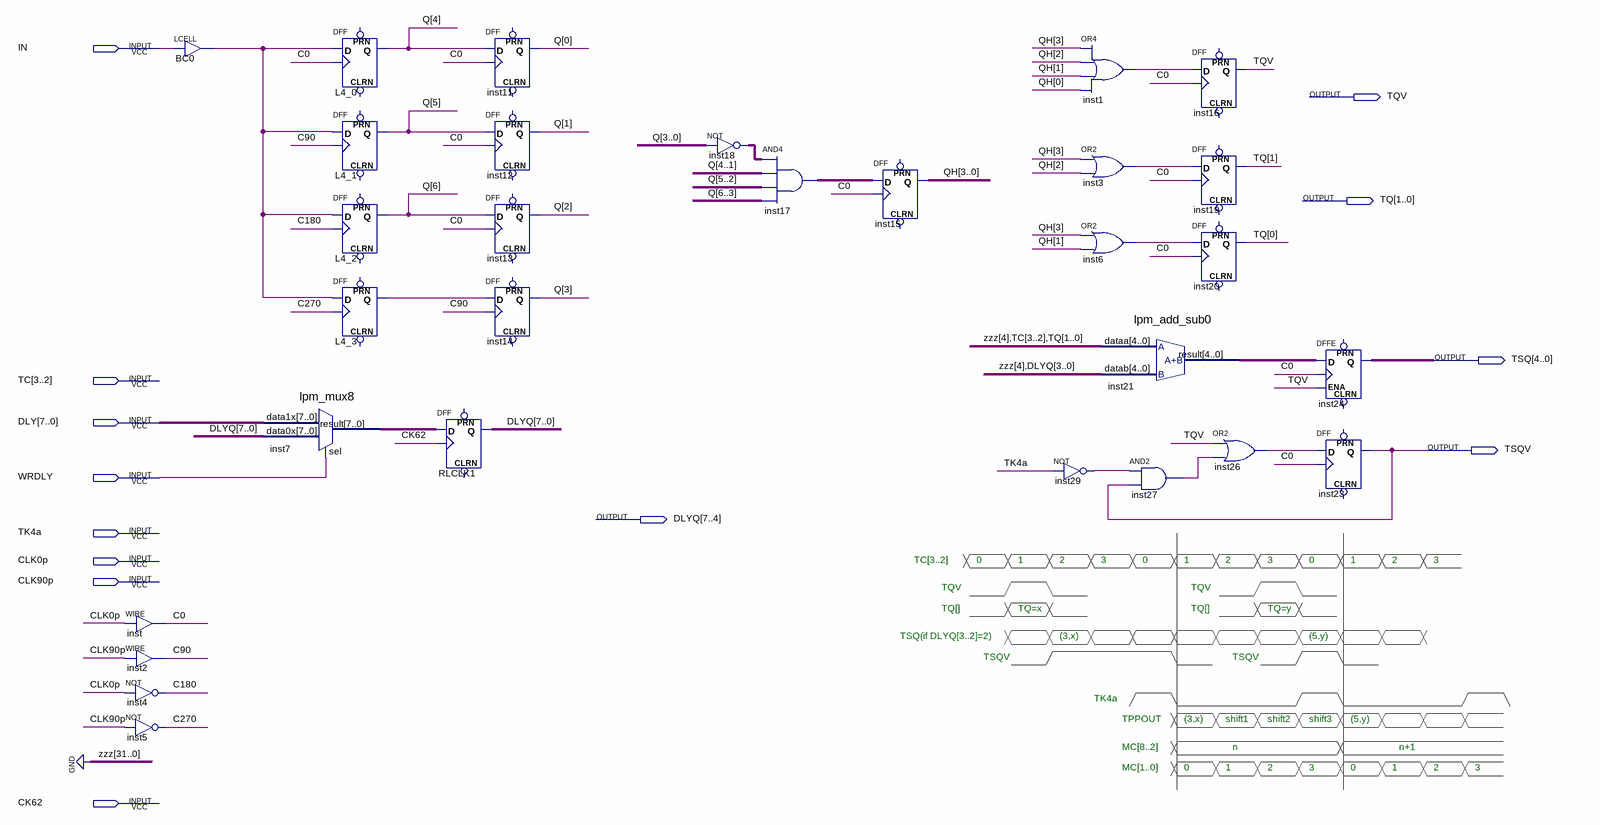
[diagram p0: schematic sheet]
// Quartus schematic Smaple4sh16a.bdf as structural Verilog: 30 symbols, 13 pins
module Smaple4sh16a (
  input  IN,
  input  [3:2] TC,
  input  [7:0] DLY,
  input  WRDLY,
  input  TK4a,
  input  CLK0p,
  input  CLK90p,
  input  CK62,
  output TQV,
  output [1:0] TQ,
  output [4:0] TSQ,
  output TSQV,
  output [7:0] DLYQ
);

  wire BC0_out, C0, C90, C180, C270, inst1_out, inst3_out, inst6_out, inst26_out, inst27_out, inst29_out,
       L4_3_q;
  wire [3:0] inst17_out, inst18_out, QH;
  wire [4:0] inst21_result;
  wire [6:0] Q;
  wire [7:0] inst7_result;

  assign C0 = CLK0p;  // WIRE inst
  assign C90 = CLK90p;  // WIRE inst2
  not inst4 (C180, CLK0p);
  not inst5 (C270, CLK90p);
  LCELL BC0 (.IN(IN), .OUT(BC0_out));
  lpm_mux8 inst7 (.data1x(DLY), .data0x(DLYQ), .sel(WRDLY), .result(inst7_result));
  DFF L4_0 (.CLK(C0), .D(BC0_out), .Q(Q[4]));  // open: CLRN, PRN
  DFF L4_1 (.CLK(C90), .D(BC0_out), .Q(Q[5]));  // open: CLRN, PRN
  DFF L4_2 (.CLK(C180), .D(BC0_out), .Q(Q[6]));  // open: CLRN, PRN
  DFF L4_3 (.CLK(C270), .D(BC0_out), .Q(L4_3_q));  // open: CLRN, PRN
  DFF RLCLK1[7:0] (.CLK(CK62), .D(inst7_result), .Q(DLYQ));  // open: CLRN, PRN
  DFF inst11 (.CLK(C0), .D(Q[4]), .Q(Q[0]));  // open: CLRN, PRN
  DFF inst12 (.CLK(C0), .D(Q[5]), .Q(Q[1]));  // open: CLRN, PRN
  DFF inst13 (.CLK(C0), .D(Q[6]), .Q(Q[2]));  // open: CLRN, PRN
  DFF inst14 (.CLK(C90), .D(L4_3_q), .Q(Q[3]));  // open: CLRN, PRN
  assign inst18_out = ~Q[3:0];  // NOT inst18, 4 bits wide
  assign inst17_out = inst18_out & Q[4:1] & Q[5:2] & Q[6:3];  // AND4 inst17, 4 bits wide
  DFF inst15[3:0] (.CLK(C0), .D(inst17_out), .Q(QH));  // open: CLRN, PRN
  or inst1 (inst1_out, QH[3], QH[2], QH[1], QH[0]);
  or inst3 (inst3_out, QH[3], QH[2]);
  or inst6 (inst6_out, QH[3], QH[1]);
  not inst29 (inst29_out, TK4a);
  lpm_add_sub0 inst21 (.dataa({1'b0, TC, TQ}), .datab({1'b0, DLYQ[3:0]}), .result(inst21_result));
  and inst27 (inst27_out, inst29_out, TSQV);
  DFF inst16 (.CLK(C0), .D(inst1_out), .Q(TQV));  // open: CLRN, PRN
  DFF inst19 (.CLK(C0), .D(inst3_out), .Q(TQ[1]));  // open: CLRN, PRN
  DFF inst20 (.CLK(C0), .D(inst6_out), .Q(TQ[0]));  // open: CLRN, PRN
  or inst26 (inst26_out, TQV, inst27_out);
  DFFE inst24[4:0] (.D(inst21_result), .CLK(C0), .ENA(TQV), .Q(TSQ));  // open: PRN, CLRN
  DFF inst23 (.CLK(C0), .D(inst26_out), .Q(TSQV));  // open: CLRN, PRN

  // Notes on the sheet:
  //   TC[3..2]
  //   0
  //   1
  //   2
  //   3
  //   0
  //   1
  //   2
  //   3
  //   0
  //   1
  //   2
  //   3
  //   TQV
  //   TQV
  //   TQ[]
  //   TQ=x
  //   TQ[]
  //   TQ=y
  //   TSQ(if DLYQ[3..2]=2)
  //   (3,x)
  //   (5,y)
  //   TSQV
  //   TSQV
  //   TK4a
  //   TPPOUT
  //   (3,x)
  //   shift1
  //   shift2
  //   shift3
  //   (5,y)
  //   MC[8..2]
  //   n
  //   n+1
  //   MC[1..0]
  //   0
  //   1
  //   2
  //   3
  //   0
  //   1
  //   2
  //   3
endmodule
